# EAGLE design powersupply (EAGLE 9.2.1)
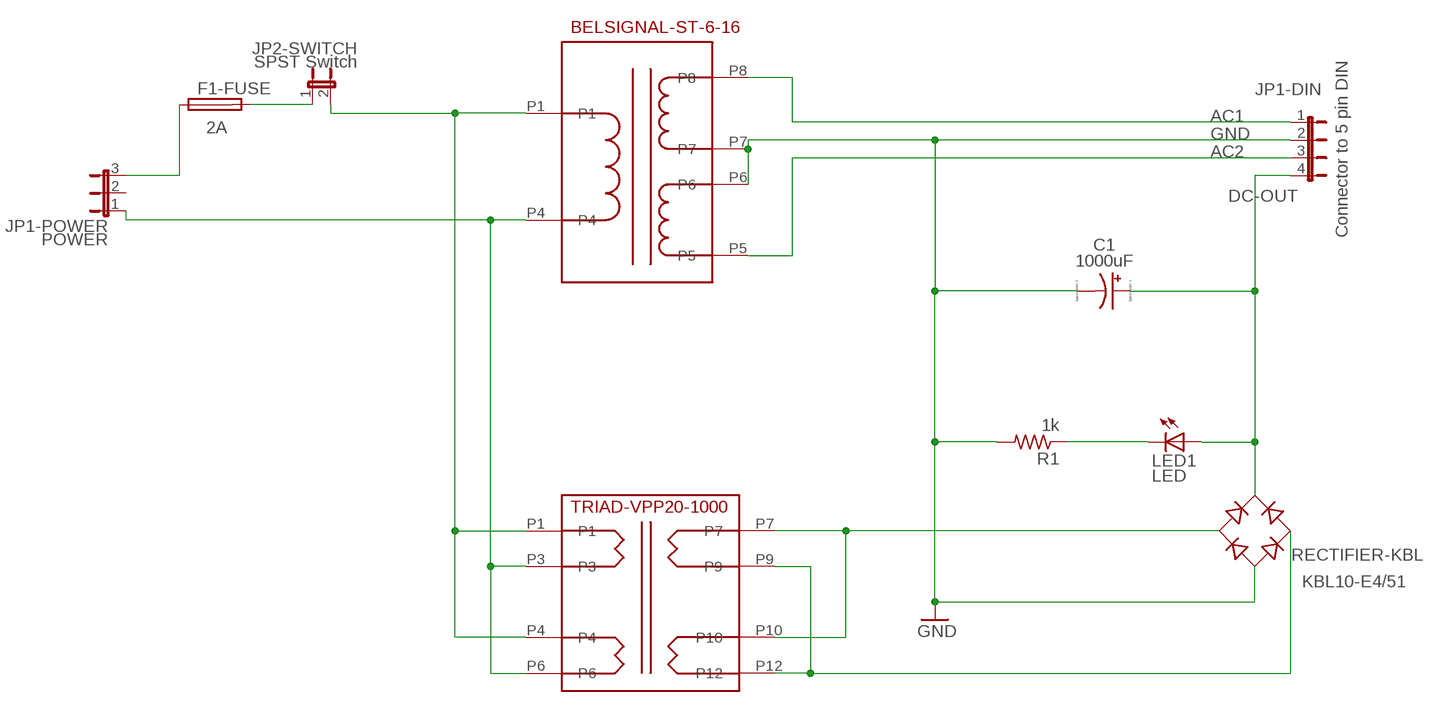
[diagram p0: schematic, sheet 1]

## Parts
BELSIGNAL-ST-6-16  ST-6-16  [ST-6-16]
C1  1000uF  CPOL-USE3.5-10  [E3,5-10]
F1-FUSE  2A  SH22,5  [SH22,5]
JP1-DIN  Connector to 5 pin DIN  JP4E  [JP4]
JP1-POWER  POWER  JP2E  [JP2]
JP2-SWITCH  SPST Switch  JP1E  [JP1]
KBL10-E4/51  RECTIFIER-KBL  [KBL]
LED1  LED  LED5MM  [LED5MM]
R1  1k  R-US_0204/7  [0204/7]
TRIAD-VPP20-1000  VPP20-1000  [VPP20-1000]

## Nets
AC1: BELSIGNAL-ST-6-16.P8 JP1-DIN.1
AC2: BELSIGNAL-ST-6-16.P5 JP1-DIN.3
AC-FOR-RECT-A: KBL10-E4/51.AC2 TRIAD-VPP20-1000.P9 TRIAD-VPP20-1000.P12
AC-FOR-RECT-B: KBL10-E4/51.AC1 TRIAD-VPP20-1000.P7 TRIAD-VPP20-1000.P10
AC-IN-2: BELSIGNAL-ST-6-16.P4 JP1-POWER.1 TRIAD-VPP20-1000.P3 TRIAD-VPP20-1000.P6
AC-IN-AFTER-FUSE: F1-FUSE.2 JP2-SWITCH.1
AC-IN-AFTER-SW: BELSIGNAL-ST-6-16.P1 JP2-SWITCH.2 TRIAD-VPP20-1000.P1 TRIAD-VPP20-1000.P4
AC-IN-BEFORE-FUSE: F1-FUSE.1 JP1-POWER.3
DC-OUT: C1.+ JP1-DIN.4 KBL10-E4/51.+ LED1.A
GND: BELSIGNAL-ST-6-16.P6 BELSIGNAL-ST-6-16.P7 C1.- JP1-DIN.2 KBL10-E4/51.- R1.2
N$1: LED1.K(C) R1.1
Unconnected: JP1-POWER.2

## Library data of the parts
BELSIGNAL-ST-6-16 = TMS99:ST-6-16: Bell Signal ST-6-16 Transformer
C1 = resistor:CPOL-US: POLARIZED CAPACITOR, American symbol
F1-FUSE = fuse:SH22,5: FUSE HOLDER grid 22,5 mm, OGN0031 8201, Schurter (Buerklin); MF: SCHURTER; MPN: 0031.8201; OC_FARNELL: 1162740; OC_NEWARK: 96F8317
JP1-DIN = jumper:JP4E: JUMPER
JP1-POWER = jumper:JP2E: JUMPER
JP2-SWITCH = jumper:JP1E: JUMPER
KBL10-E4/51 = rectifier:RECTIFIER-: Rectifier
LED1 = led:LED: LED OSRAM: - CHIPLED LG R971, LG N971, LY N971, LG Q971, LY Q971, LO R971, LY R971 LH N974, LH R974 LS Q976, LO Q976, LY Q976 LO Q996 - Hyper CHIPLED LW Q18S LB Q993, LB Q99A, LB R99A - SideLED LS A670, LO A670, LY A670, LG A670, LP A670 LB A673, LV A673, LT A673, LW A673 LH A674 LY A675 LS A676, LA A676, LO A676, LY A676, LW A676 LS A679, LY A679, LG A679 - Hyper Micro SIDELED® LS Y876, LA Y876, LO Y876, LY Y876 LT Y87S - SmartLED LW L88C, LW L88S LB L89C, LB L89S, LG L890 LS L89K, LO L89K, LY L89K LS L896, LA L896, LO L896, LY L896 - TOPLED LS T670, LO T670, LY T670, LG T670, LP T670 LSG T670, LSP T670, LSY T670, LOP T670, LYG T670 LG T671, LOG T671, LSG T671 LB T673, LV T673, LT T673, LW T673 LH T674 LS T676, LA T676, LO T676, LY T676, LB T676, LH T676, LSB T676, LW T676 LB T67C, LV T67C, LT T67C, LS T67K, LO T67K, LY T67K, LW E67C LS E67B, LA E67B, LO E67B, LY E67B, LB E67C, LV E67C, LT E67C LW T67C LS T679, LY T679, LG T679 LS T770, LO T770, LY T770, LG T770, LP T770 LB T773, LV T773, LT T773, LW T773 LH T774 LS E675, LA E675, LY E675, LS T675 LS T776, LA T776, LO T776, LY T776, LB T776 LHGB T686 LT T68C, LB T68C - Hyper Mini TOPLED® LB M676 - Mini TOPLED Santana® LG M470 LS M47K, LO M47K, LY M47K Source: http://www.osram.convergy.de LUXEON: - LUMILED® LXK2-PW12-R00, LXK2-PW12-S00, LXK2-PW14-U00, LXK2-PW14-V00 LXK2-PM12-R00, LXK2-PM12-S00, LXK2-PM14-U00 LXK2-PE12-Q00, LXK2-PE12-R00, LXK2-PE12-S00, LXK2-PE14-T00, LXK2-PE14-U00 LXK2-PB12-K00, LXK2-PB12-L00, LXK2-PB12-M00, LXK2-PB14-N00, LXK2-PB14-P00, LXK2-PB14-Q00 LXK2-PR12-L00, LXK2-PR12-M00, LXK2-PR14-Q00, LXK2-PR14-R00 LXK2-PD12-Q00, LXK2-PD12-R00, LXK2-PD12-S00 LXK2-PH12-R00, LXK2-PH12-S00 LXK2-PL12-P00, LXK2-PL12-Q00, LXK2-PL12-R00 Source: www.luxeon.com KINGBRIGHT: KA-3528ASYC Source: www.kingbright.com
R1 = resistor:R-US_: RESISTOR, American symbol
TRIAD-VPP20-1000 = TMS99:VPP20-1000: TRIAD VPP20-1000

## Board
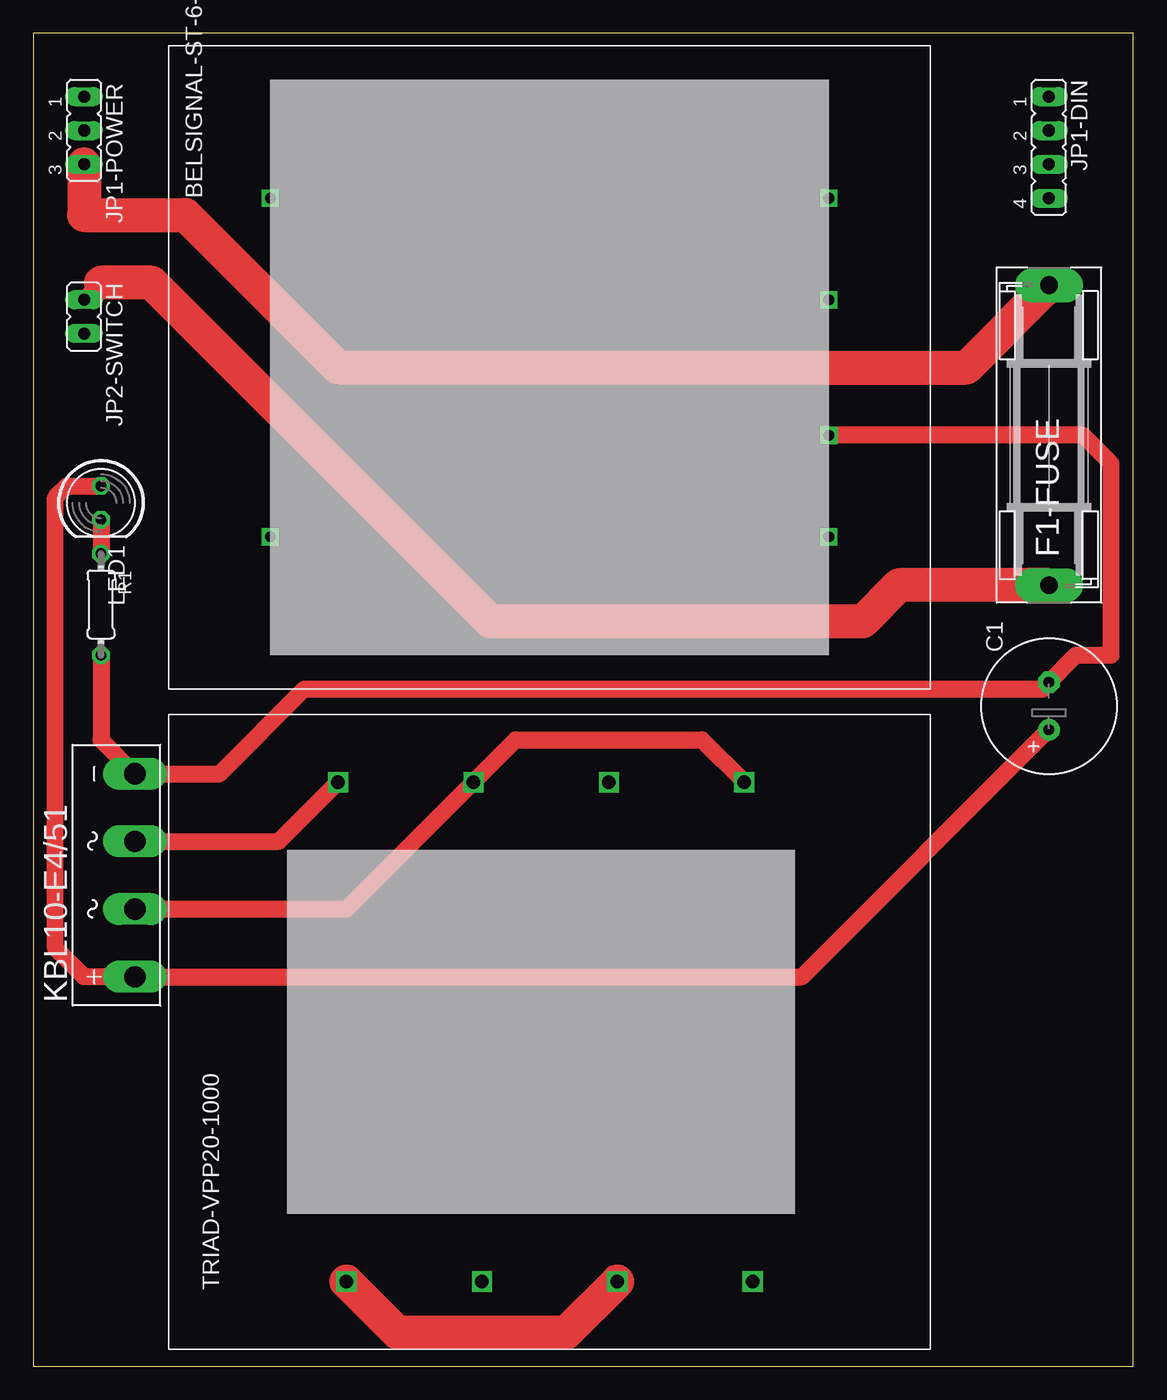
[diagram p1: board, top side]
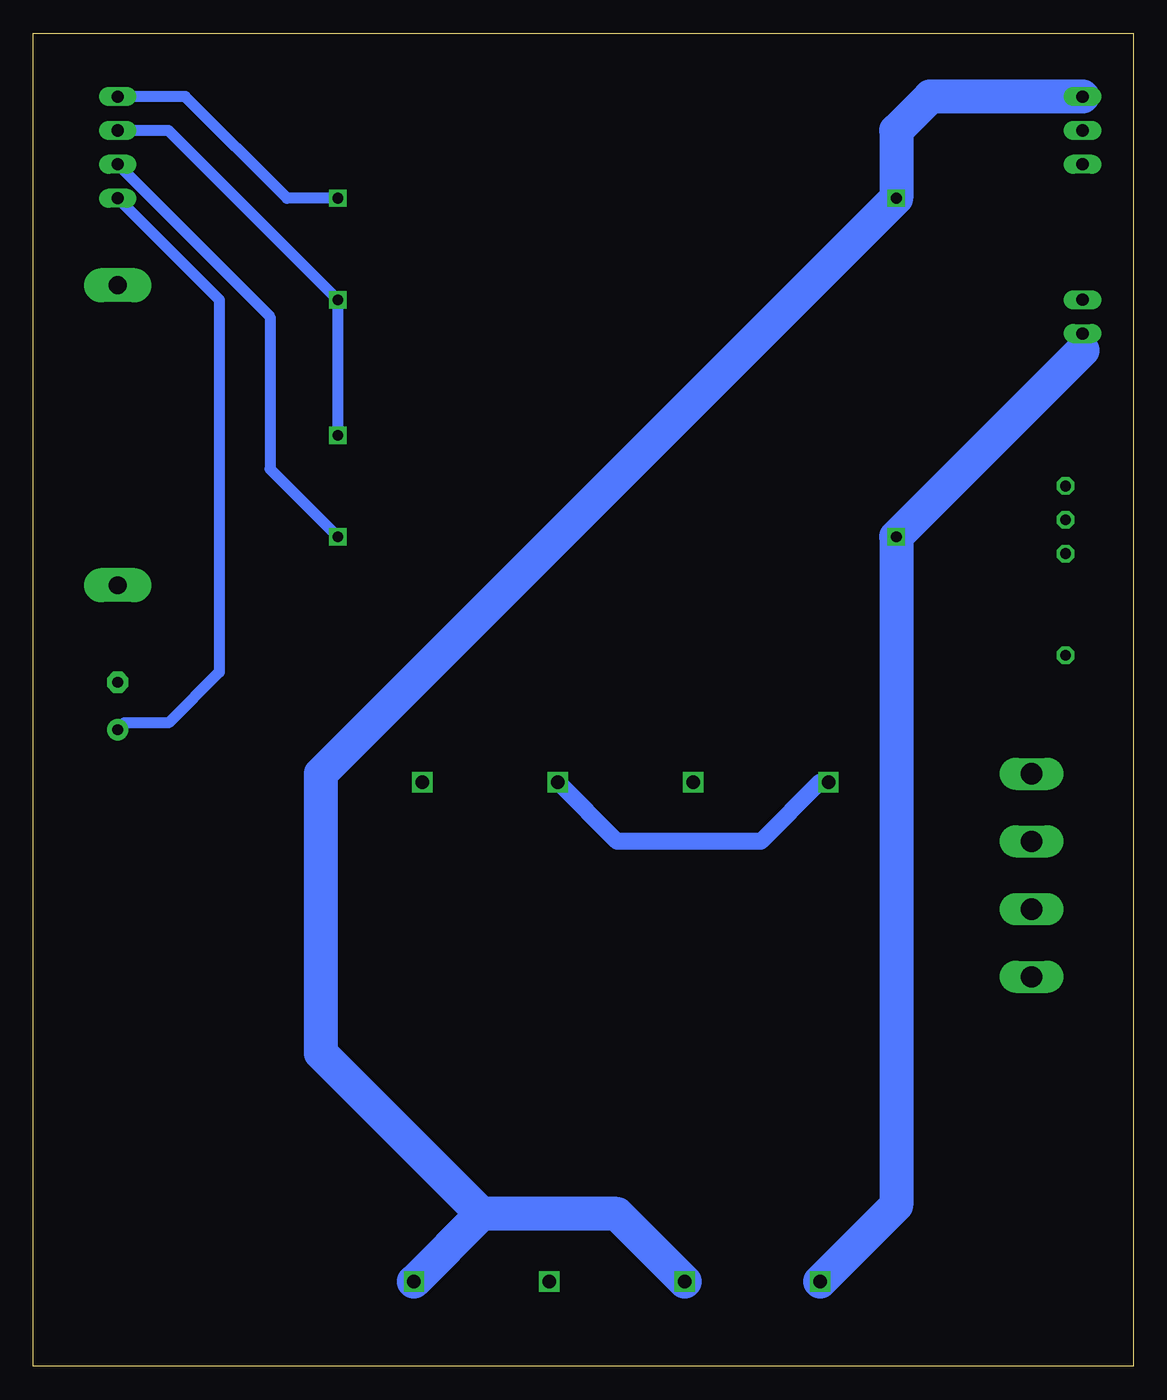
[diagram p2: board, bottom side, seen from below]

Size 82.53 x 100 mm. Coordinates in mm from the lower left corner, seen from the top.
Outline: 0,0 82.53,0 82.53,100 0,100 0,0
Copper layers (1*16): Top 0.035mm / dielectric 1.5mm / Bottom 0.035mm
Design rules "default": minimum track width 6mil, minimum drill 0.35mm, track to track 6mil, track to pad 6mil, pad to pad 6mil, via to via 6mil, smd to smd 6mil, copper to edge 40mil, drill to drill 6mil, minimum pad ring 10mil, minimum via ring 8mil, stop-mask expansion 4mil, vias tented up to drill 0mil, thermal gap 10mil

### Footprints (pad centres in the part's own frame; a part is rotated, then mirrored left to right if it is on the bottom)
ST-6-16 = drill 0.8 square: P1 7.62,11.43; P4 7.62,36.83; P5 49.53,11.43; P6 49.53,19.05; P7 49.53,29.21; P8 49.53,36.83
E3,5-10 = drill 0.813 pad 1.6: + -1.778,0 | drill 0.813 pad 1.6 octagon: - 1.778,0
SH22,5 = drill 1.321 pad 2.54 long: 1 -11.252,0; 2 11.252,0
JP4 = drill 0.914 long: 1 -3.81,0; 2 -1.27,0; 3 1.27,0; 4 3.81,0
JP2 = drill 0.914 long: 1 -2.54,0; 2 0,0; 3 2.54,0
JP1 = drill 0.914 long: 1 0,-1.27; 2 0,1.27
KBL = drill 1.6 long: + -7.62,-1.27; - 7.62,-1.27; AC1 2.54,-1.27; AC2 -2.54,-1.27
LED5MM = drill 0.813 octagon: A -1.27,0; K 1.27,0
0204/7 = drill 0.813 octagon: 1 -3.81,0; 2 3.81,0
VPP20-1000 = drill 1 square: P1 5.08,43.815; P3 5.08,33.655; P4 5.08,23.495; P6 5.08,13.335; P7 42.545,44.45; P9 42.545,34.29; P10 42.545,24.13; P12 42.545,13.97

### Placement (x,y rotation side)
BELSIGNAL-ST-6-16  10.16,50.8 0 top
C1  76.2,49.53 90 top
F1-FUSE  76.2,69.85 270 top
JP1-DIN  76.2,91.44 270 top
JP1-POWER  3.81,92.71 270 top
JP2-SWITCH  3.81,78.74 180 top
KBL10-E4/51  6.35,36.83 90 top
LED1  5.08,64.77 270 top
R1  5.08,57.15 270 top
TRIAD-VPP20-1000  67.31,1.27 90 top

### Tracks (layer width: path | path; a pad name or v marks a point on that pad's centre or on a via)
AC1
  Bottom 0.813: BELSIGNAL-ST-6-16.P8 63.5,87.63 71.12,95.25 JP1-DIN.1
AC2
  Bottom 0.813: JP1-DIN.3 64.77,78.74 64.77,67.31 BELSIGNAL-ST-6-16.P5
AC-FOR-RECT-A
  Top 1.27: KBL10-E4/51.AC2 23.5,34.29 TRIAD-VPP20-1000.P9 36.2,46.99 50.16,46.99 TRIAD-VPP20-1000.P12
AC-FOR-RECT-B
  Top 1.27: KBL10-E4/51.AC1 18.41,39.37 TRIAD-VPP20-1000.P7
  Bottom 1.27: TRIAD-VPP20-1000.P7 23.5,43.81 27.94,39.37 38.73,39.37 TRIAD-VPP20-1000.P10
AC-IN-2
  Bottom 2.54: JP1-POWER.1 15.24,95.25 17.78,92.71 BELSIGNAL-ST-6-16.P4 60.96,44.45 60.96,23.5 48.9,11.43 | TRIAD-VPP20-1000.P3 38.73,11.43 48.9,11.43 | 48.9,11.43 TRIAD-VPP20-1000.P6
AC-IN-AFTER-FUSE
  Top 1.27: 5.08,81.28 JP2-SWITCH.1
  Top 2.54: F1-FUSE.2 64.95,58.6 62.23,55.88 34.29,55.88 8.89,81.28 5.08,81.28
AC-IN-AFTER-SW
  Top 2.54: TRIAD-VPP20-1000.P1 27.3,2.54 40.01,2.54 TRIAD-VPP20-1000.P4
  Bottom 1.27: JP2-SWITCH.2 3.81,76.2
  Bottom 2.54: 3.81,76.2 BELSIGNAL-ST-6-16.P1 17.78,12.06 TRIAD-VPP20-1000.P1
AC-IN-BEFORE-FUSE
  Top 2.54: JP1-POWER.3 3.81,86.36 11.43,86.36 22.86,74.93 70.03,74.93 F1-FUSE.1
DC-OUT
  Top 1.27: C1.+ 57.66,29.21 KBL10-E4/51.+ 3.81,29.21 1.65,31.37 1.65,65.15 2.54,66.04 LED1.A
  Bottom 0.813: JP1-DIN.4 68.58,80.01 68.58,52.07 72.39,48.26 75.69,48.26 C1.+
GND
  Top 1.27: BELSIGNAL-ST-6-16.P6 78.74,69.85 80.88,67.71 80.88,53.34 78.23,53.34 C1.- 75.69,50.8 20.32,50.8 13.97,44.45 KBL10-E4/51.- 5.08,46.99 R1.2
  Bottom 0.813: JP1-DIN.2 72.39,92.71 BELSIGNAL-ST-6-16.P7 BELSIGNAL-ST-6-16.P6
N$1
  Top 1.27: LED1.K R1.1